# Altium schematic sheet Блок2.SchDoc
size A4; DocumentNumber: 5; SheetNumber: 5; SheetTotal: 12
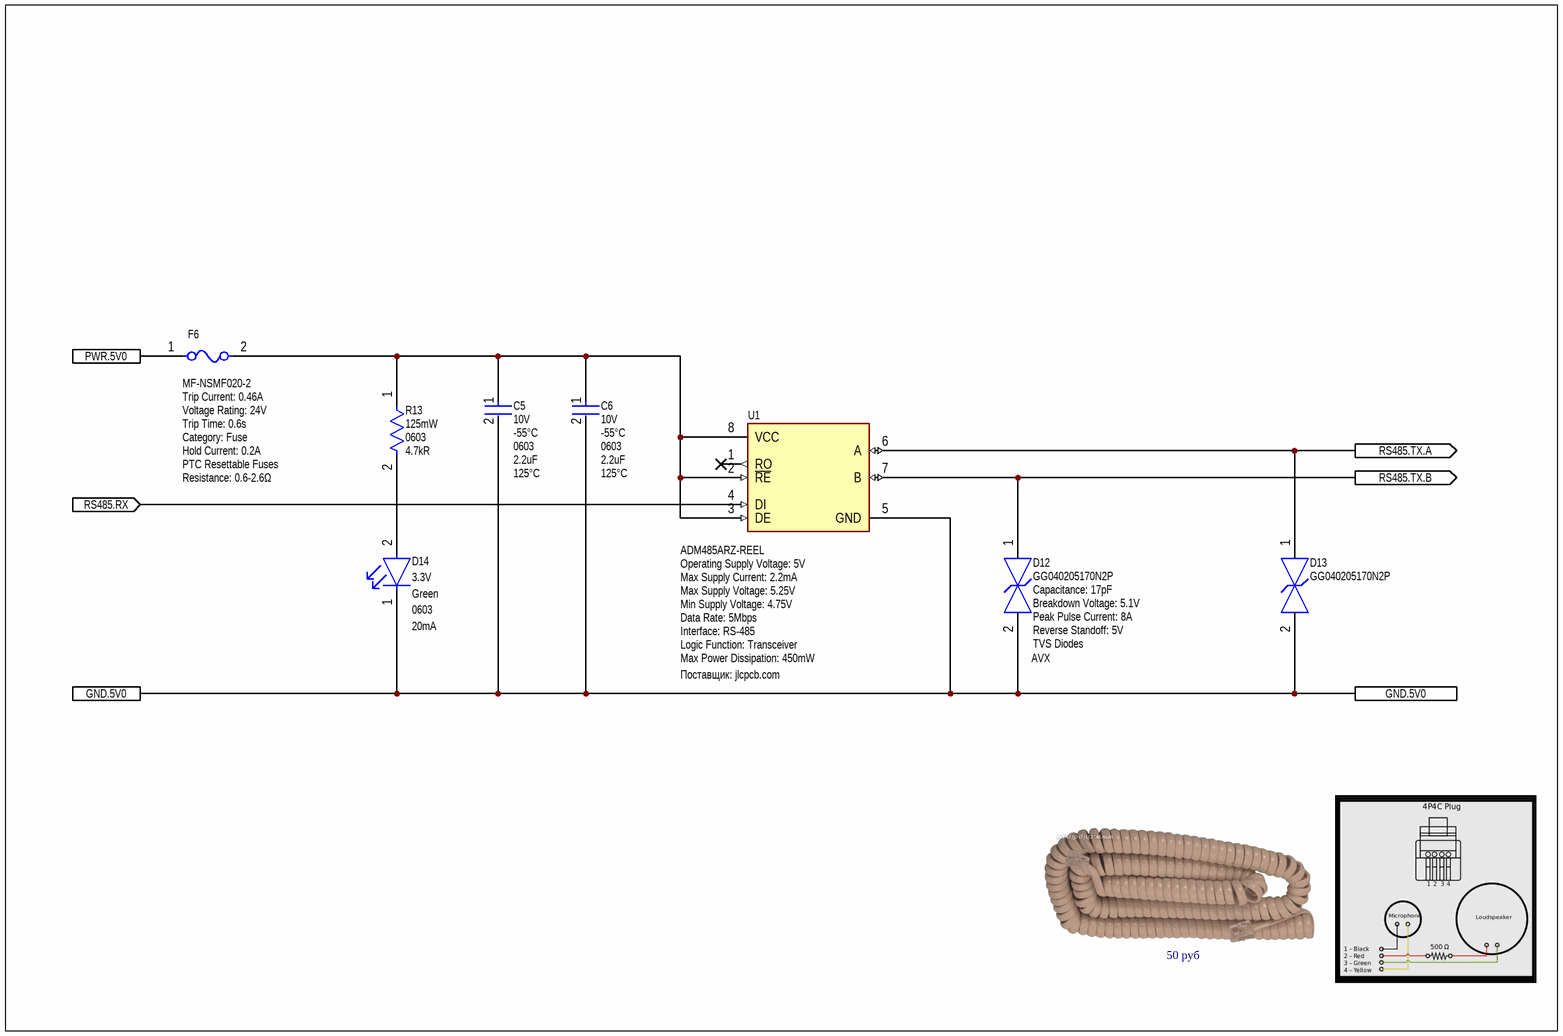
[diagram p0: Блок2.SchDoc]

## Parts
C5  Voltage Rating: 10V  Min Operating Temperature: -55°C  Case Code (Imperial): 0603  Capacitance: 2.2uF  Max Operating Temperature: 125°C  [FP-CL10-IPC_A]  (hidden comment: CL10B225KP8NFNC)
C6  Voltage Rating: 10V  Min Operating Temperature: -55°C  Case Code (Imperial): 0603  Capacitance: 2.2uF  Max Operating Temperature: 125°C  [FP-CL10-IPC_A]  (hidden comment: CL10B225KP8NFNC)
D12  GG040205170N2P  Capacitance: 17pF  Manufacturer: AVX  Breakdown Voltage: 5.1V  Peak Pulse Current: 8A  Reverse Standoff: 5V  Device Class L2: TVS Diodes  [FP-GG0402-IPC_A]
D13  GG040205170N2P  [FP-GG0402-IPC_A]
D14  Forward Voltage: 3.3V  Color: Green  Case/Package: 0603  Forward Current: 20mA  [FP-APT1608ZGCK-MFG]  (hidden comment: APT1608ZGCK)
F6  MF-NSMF020-2  Trip Current: 0.46A  Voltage Rating: 24V  Trip Time: 0.6s  Category: Fuse  Hold Current: 0.2A  Device Class L2: PTC Resettable Fuses  Resistance: 0.6-2.6Ω  [FP-MF-NSMF020-2-MFG]
R13  Power Rating: 125mW  Case/Package: 0603  Resistance: 4.7kR  [FP-MCT0603-MFG]  (hidden comment: MCT06030C4701FP500)
U1  ADM485ARZ-REEL  Max Power Dissipation: 450mW  Max Supply Current: 2.2mA  Max Supply Voltage: 5.25V  Min Supply Voltage: 4.75V  Logic Function: Transceiver  Operating Supply Voltage: 5V  Data Rate: 5Mbps  Interface: RS-485  Поставщик: jlcpcb.com  [FP-R-8-IPC_C]

## Ports
GND.5V0, PWR.5V0, RS485.RX (in), RS485.TX.A (out), RS485.TX.B (out)

## Nets
GND.5V0: C5.2 C6.2 D12.2 D13.2 D14.1(C) U1.5(GND) ; port GND.5V0
PWR.5V0: F6.1 ; port PWR.5V0
RS485.RX: U1.4(DI) ; port RS485.RX
RS485.TX.A: D13.1 U1.6(A) ; port RS485.TX.A
RS485.TX.B: D12.1 U1.7(B) ; port RS485.TX.B
NetC5_1: C5.1 C6.1 F6.2 R13.1 U1.2(~{RE}) U1.3(DE) U1.8(VCC)
NetD14_2: D14.2(A) R13.2

Not connected (* = marked no-connect by the designer): U1 1(RO)*

## Notes on the sheet
- 50 руб

## Library data of the parts
C5 C6 = CMP-13271-000561-1: Cap Ceramic 2.2uF 10V X7R ±10% Pad SMD 0603 +125°C T/R; Thickness: 0.035inch; Radiation Hardening: No; Mount: Surface Mount; Dielectric: X7R; Case Code (Metric): 1608; Package Quantity: 1; Width: 0.031inch; Case/Package: 0603; Height: 0.8mm; Depth: 0.8mm; Packaging: Tape and Reel; Length: 0.063inch; Tolerance: 10%
D12 = CMP-04587-000002-1: TVS DIODE 5V 10V 0402; Peak Pulse Power: 80W; Value: 17pF; Number Of Channels: 1; Direction: Bidirectional; Manufacturer Part Number: GG040205170N2P; Temperature: -55°C to +125°C; Octopart: https://octopart.com/gg040205170n2p-avx-81066082; RoHS: TRUE; Clamping Voltage: 10V; Device Class L1: Circuit Protection; ComponentLink2Description: Datasheet; Category: Diode; Package: GG0402; Temperature Range High: +125°C; Digikey Description: TVS DIODE 5V 10V 0402; Ipc Land Pattern Name: DIOC10060X50; Device Class L3: unset; Automotive: No; Mouser Description: ESD Suppressor TVS Bi-Dir 5V 2-Pin Case 0402(1006Metric) T/R; ComponentLink2URL: http://datasheets.avx.com/AVX-GiGuard.pdf; Height: 0.55mm; Lead Free: Yes; Temperature Range Low: -55°C
D13 = CMP-04587-000002-1: TVS DIODE 5V 10V 0402; Manufacturer: AVX; Capacitance: 17pF; Peak Pulse Power: 80W; Value: 17pF; Number Of Channels: 1; Direction: Bidirectional; Breakdown Voltage: 5.1V; Peak Pulse Current: 8A; Manufacturer Part Number: GG040205170N2P; Temperature: -55°C to +125°C; Octopart: https://octopart.com/gg040205170n2p-avx-81066082; RoHS: TRUE; Clamping Voltage: 10V; Device Class L1: Circuit Protection; ComponentLink2Description: Datasheet; Category: Diode; Package: GG0402; Temperature Range High: +125°C; Digikey Description: TVS DIODE 5V 10V 0402; Ipc Land Pattern Name: DIOC10060X50; Device Class L3: unset; Automotive: No; Mouser Description: ESD Suppressor TVS Bi-Dir 5V 2-Pin Case 0402(1006Metric) T/R; ComponentLink2URL: http://datasheets.avx.com/AVX-GiGuard.pdf; Height: 0.55mm; Lead Free: Yes; Reverse Standoff Voltage: 5V; Device Class L2: TVS Diodes; Temperature Range Low: -55°C
D14 = CMP-44529-000024-1: LED GREEN CLEAR CHIP SMD; Dominant Wavelength: 525nm; Lens Color: Colorless; Viewing Angle: 120°; Luminous Intensity: 350mcd; Lens Transparency: Clear; Max Operating Temperature: 85°C; Mount: Surface Mount; Min Operating Temperature: -40°C; Case Code (Metric): 1608; Test Current: 20mA; Packaging: Tape and Reel; Width: 0.8mm; Package Quantity: 1; Height: 0.75mm; Length: 1.6mm; Illumination Color: Green; Lead Free: Lead Free; Case Code (Imperial): 0603
F6 = CMP-07400-000029-1: PTC RESET FUSE 24V 200MA 1206; Manufacturer: Bourns; Current Rating: 10A; Automotive Grade: Grade 3; Value: 0.6-2.6Ω; Ambient Temperature Range Low: -40°C; Device Class L1: Circuit Protection; Temperature Range Low: -40°C; Temperature: -40°C to +85°C; Temperature Range High: +85°C; Mouser Description: Resettable Fuses - PPTC 0.20A 24V 0.60ohm MAX (R); Device Class L3: unset; RoHS: TRUE; Package: MF-NSMF020-2; Ambient Temperature Range High: +85°C; ComponentLink2Description: Datasheet; Digikey Description: PTC RESET FUSE 24V 200MA 1206; Manufacturer Part Number: MF-NSMF020-2; Octopart: https://octopart.com/mf-nsmf020-2-bourns-94649; Automotive: Yes; Height: 0.85mm; Lead Free: Yes; ComponentLink2URL: https://www.bourns.com/docs/Product-Datasheets/mfnsmf.pdf
R13 = CMP-02407-001733-1: RES SMD 100 OHM 1% 1/8W 0603; Voltage Rating: 75V; Temperature Coefficient: 50ppm/°C; Length: 1.55mm; Composition: Thin Film; Mount: Surface Mount; Max Operating Temperature: 125°C; Width: 0.033inch; Radiation Hardening: No; Depth: 0.85mm; Military Standard: Not; Case Code (Imperial): 0603; Case Code (Metric): 1608; Contact Plating: Tin; Packaging: Tape and Reel; Tolerance: 1%; Lead Free: Lead Free; REACH SVHC: No SVHC; Max Power Dissipation: 125mW; Min Operating Temperature: -55°C; Package Quantity: 1; Number of Terminations: 2; Voltage Rating (DC): 75V; Height: 0.022inch
U1 = CMP-09096-000025-1: IC TRANSCEIVER HALF 1/1 8SOIC; Propagation Delay: 10ns; ESD Protection: Yes; Number of Transmitters: 1; Output Voltage: 2V; Receiver Hysteresis: 70mV; Simplex/Duplex: Half Duplex; Height: 1.5mm; Nominal Supply Current: 2.2mA; Radiation Hardening: No; Number of Transceivers: 1; Contact Plating: Tin; Weight: 0.019048oz; REACH SVHC: No SVHC; Number of Drivers: 1; Max Operating Temperature: 85°C; Case/Package: SOIC; Package Quantity: 2500; Mount: Surface Mount; Min Operating Temperature: -40°C; Packaging: Tape and Reel; Width: 4mm; Length: 5mm; Operating Supply Current: 2.2mA; Number of Pins: 8; Lead Free: Contains Lead; Number of Receivers: 1